# EAGLE design pcb-bme280-breakout (EAGLE 7.4.0)
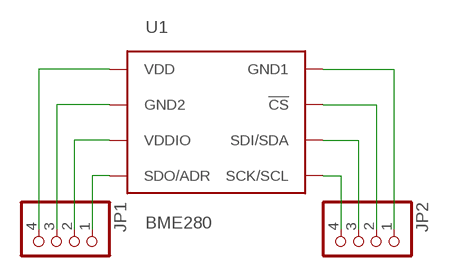
[diagram p0: schematic, sheet 1]

## Parts
JP1  PINHD-1X4  [1X04]
JP2  PINHD-1X4  [1X04]
U1  BME280  [BME280_LGA]

## Nets
N$1: JP1.4 U1.P$8(VDD)
N$2: JP1.3 U1.P$7(GND2)
N$3: JP1.2 U1.P$6(VDDIO)
N$4: JP1.1 U1.P$5(SDO/ADR)
N$5: JP2.4 U1.P$4(SCK/SCL)
N$6: JP2.3 U1.P$3(SDI/SDA)
N$7: JP2.2 U1.P$2(!CS)
N$8: JP2.1 U1.P$1(GND1)

## Library data of the parts
JP1 JP2 = pinhead+:PINHD-1X4: PIN HEADER
U1 = BME280ComponentLibrary:BME280; PROD_ID: IC-13090

## Board
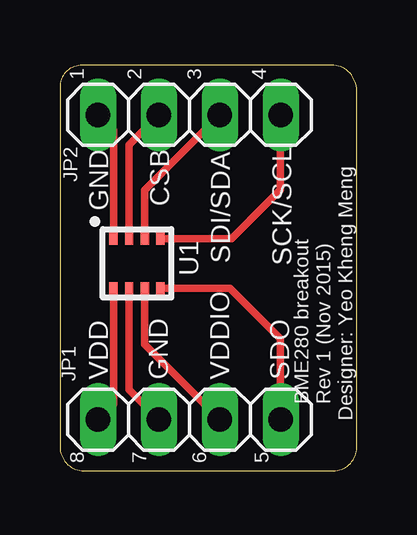
[diagram p1: board, top side]

Size 12.38 x 16.9 mm. Coordinates in mm from the lower left corner, seen from the top.
Outline: 12.38,0.98 12.38,15.85 arc90 11.33,16.9 0.92,16.9 arc90 0,15.98 0,1 arc90 1,0 11.4,0 arc90 12.38,0.98
Copper layers (1*16): Top 0.035mm / dielectric 1.6mm / Bottom 0.035mm
Design rules "Elecrow_2-layer_PCB_eagle_rule": minimum track width 6mil, minimum drill 12mil, track to track 6mil, track to pad 6mil, pad to pad 6mil, via to via 8mil, smd to smd 0mil, copper to edge 20mil, drill to drill 10mil, minimum pad ring 6mil, minimum via ring 6mil, stop-mask expansion 0mil, vias tented up to drill 100mil, thermal gap 10mil

### Footprints (pad centres in the part's own frame; a part is rotated, then mirrored left to right if it is on the bottom)
1X04 = drill 1.016 long: 1 -3.81,0; 2 -1.27,0; 3 1.27,0; 4 3.81,0
BME280_LGA = smd 0.5 x 0.35: P$1 1.025,0.975; P$2 1.025,0.325; P$3 1.025,-0.325; P$4 1.025,-0.975; P$5 -1.025,-0.975; P$6 -1.025,-0.325; P$7 -1.025,0.325; P$8 -1.025,0.975

### Placement (x,y rotation side)
JP1  5.4,2.13 180 top
JP2  5.4,14.83 0 top
U1  3.21,8.64 90 top

### Tracks (layer width: path | path; a pad name or v marks a point on that pad's centre or on a via)
N$1
  Top 0.305: U1.P$8 2.23,2.77 JP1.4
N$2
  Top 0.305: U1.P$7 2.88,3.38 JP1.3
N$3
  Top 0.305: U1.P$6 3.54,5.26 JP1.2
N$4
  Top 0.305: U1.P$5 7.08,7.62 9.2,5.5 JP1.1
N$5
  Top 0.305: U1.P$4 7.17,9.66 9.2,11.7 JP2.4
N$6
  Top 0.305: U1.P$3 3.54,11.7 JP2.3
N$7
  Top 0.305: U1.P$2 2.88,13.59 JP2.2
N$8
  Top 0.305: U1.P$1 2.23,14.19 JP2.1

### Text on the board
tPlace: 1 | 2 | 3 | 4 | SCK/SCL | GND | CSB | SDI/SDA | VDD | GND | VDDIO | SDO | BME280 breakout / Rev 1 (Nov 2015) / Designer: Yeo Kheng Meng | 8 | 7 | 6 | 5